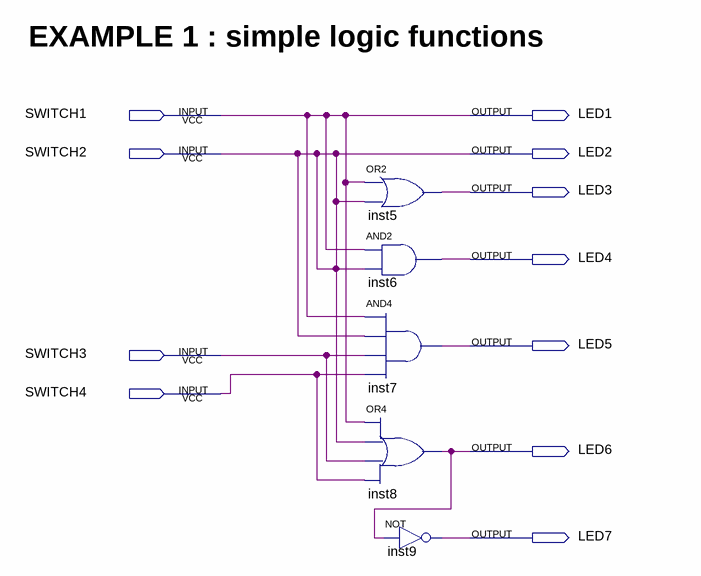
[diagram p0: schematic sheet]
// Quartus schematic ex1.bdf as structural Verilog: 5 symbols, 11 pins
module ex1 (
  input  SWITCH1,
  input  SWITCH2,
  input  SWITCH3,
  input  SWITCH4,
  output LED1,
  output LED2,
  output LED3,
  output LED4,
  output LED5,
  output LED6,
  output LED7
);

  or inst5 (LED3, SWITCH1, SWITCH2);
  and inst6 (LED4, SWITCH1, SWITCH2);
  and inst7 (LED5, SWITCH1, SWITCH2, SWITCH3, SWITCH4);
  or inst8 (LED6, SWITCH1, SWITCH2, SWITCH3, SWITCH4);
  not inst9 (LED7, LED6);

  assign LED1 = SWITCH1;
  assign LED2 = SWITCH2;

  // Notes on the sheet:
  //   EXAMPLE 1 : simple logic functions
endmodule
